# EAGLE design Grove - HCHO Sensor (EAGLE 6.3)
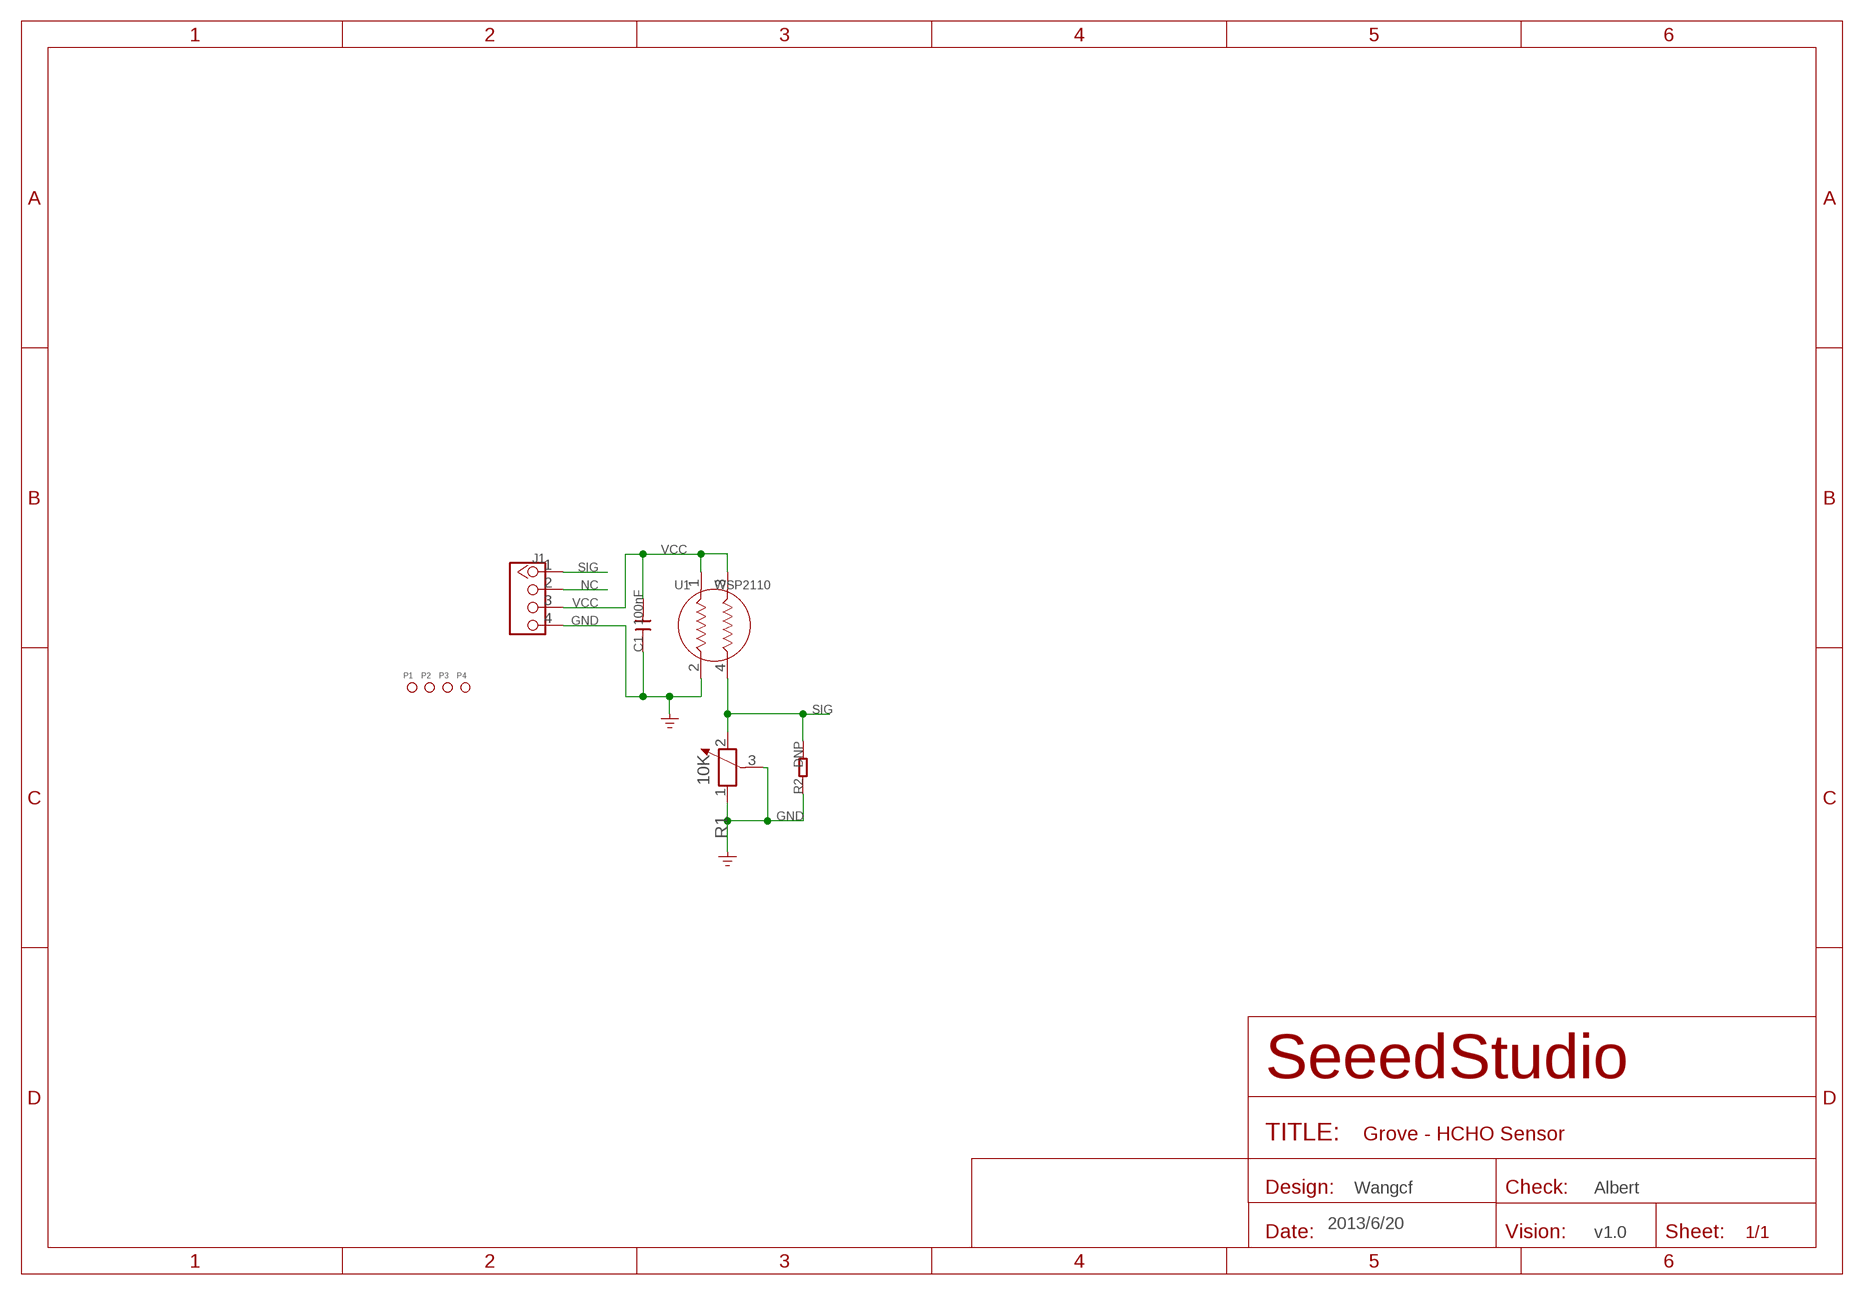
[diagram p0: schematic, sheet 1]

## Parts
C1  100nF  C-0603  [C0603]
J1  TWIG-4P-2.0-2.0  [4P-2.0]
P1  PAD-MARK  [ROUND-MARK-1.0]
P2  PAD-MARK  [ROUND-MARK-1.0]
P3  PAD-MARK  [ROUND-MARK-1.0]
P4  PAD-MARK  [ROUND-MARK-1.0]
R1  10K  R-POTENTIOMETER'3362'  [3P-SQUA-7X6.8]
R2  DNP  R-0603  [R0603]
U1  WSP2110  [4P-D9.4-7.5H]

## Nets
GND: C1.1 J1.4 R1.1 R1.3 R2.1 U1.2
NC: J1.2
SIG: J1.1 R1.2 R2.2 U1.4
VCC: C1.2 J1.3 U1.1 U1.3

## Notes on the sheet
- Wangcf | Albert
- 2013/6/20
- v1.0

## Library data of the parts
C1 = Discrete1:C*: Ceramic Capacitors
J1 = Connector :TWIG-4P-2.0
P1-P4 = Discrete:PAD-MARK; PARTNO: DNP
R1 = Discrete1:R-POTENTIOMETER*: Potentiometer
R2 = Discrete1:R*
U1 = template:WSP2110

## Board
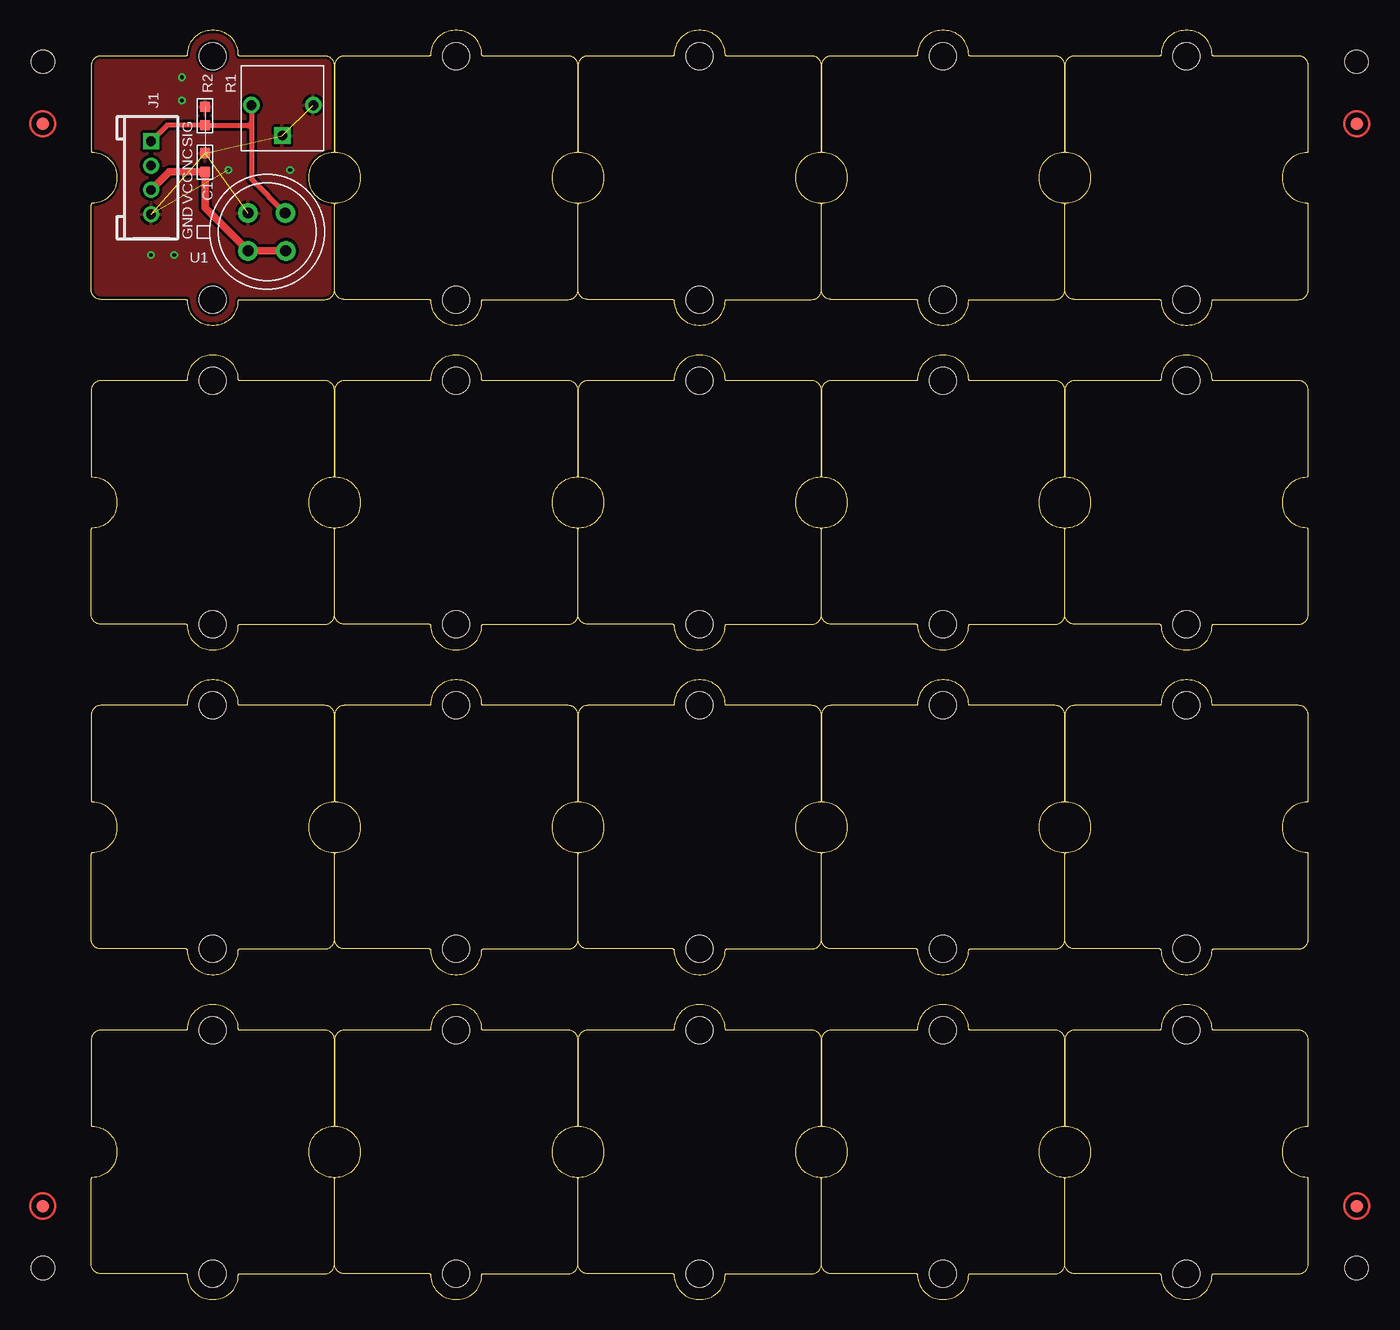
[diagram p1: board, top side]
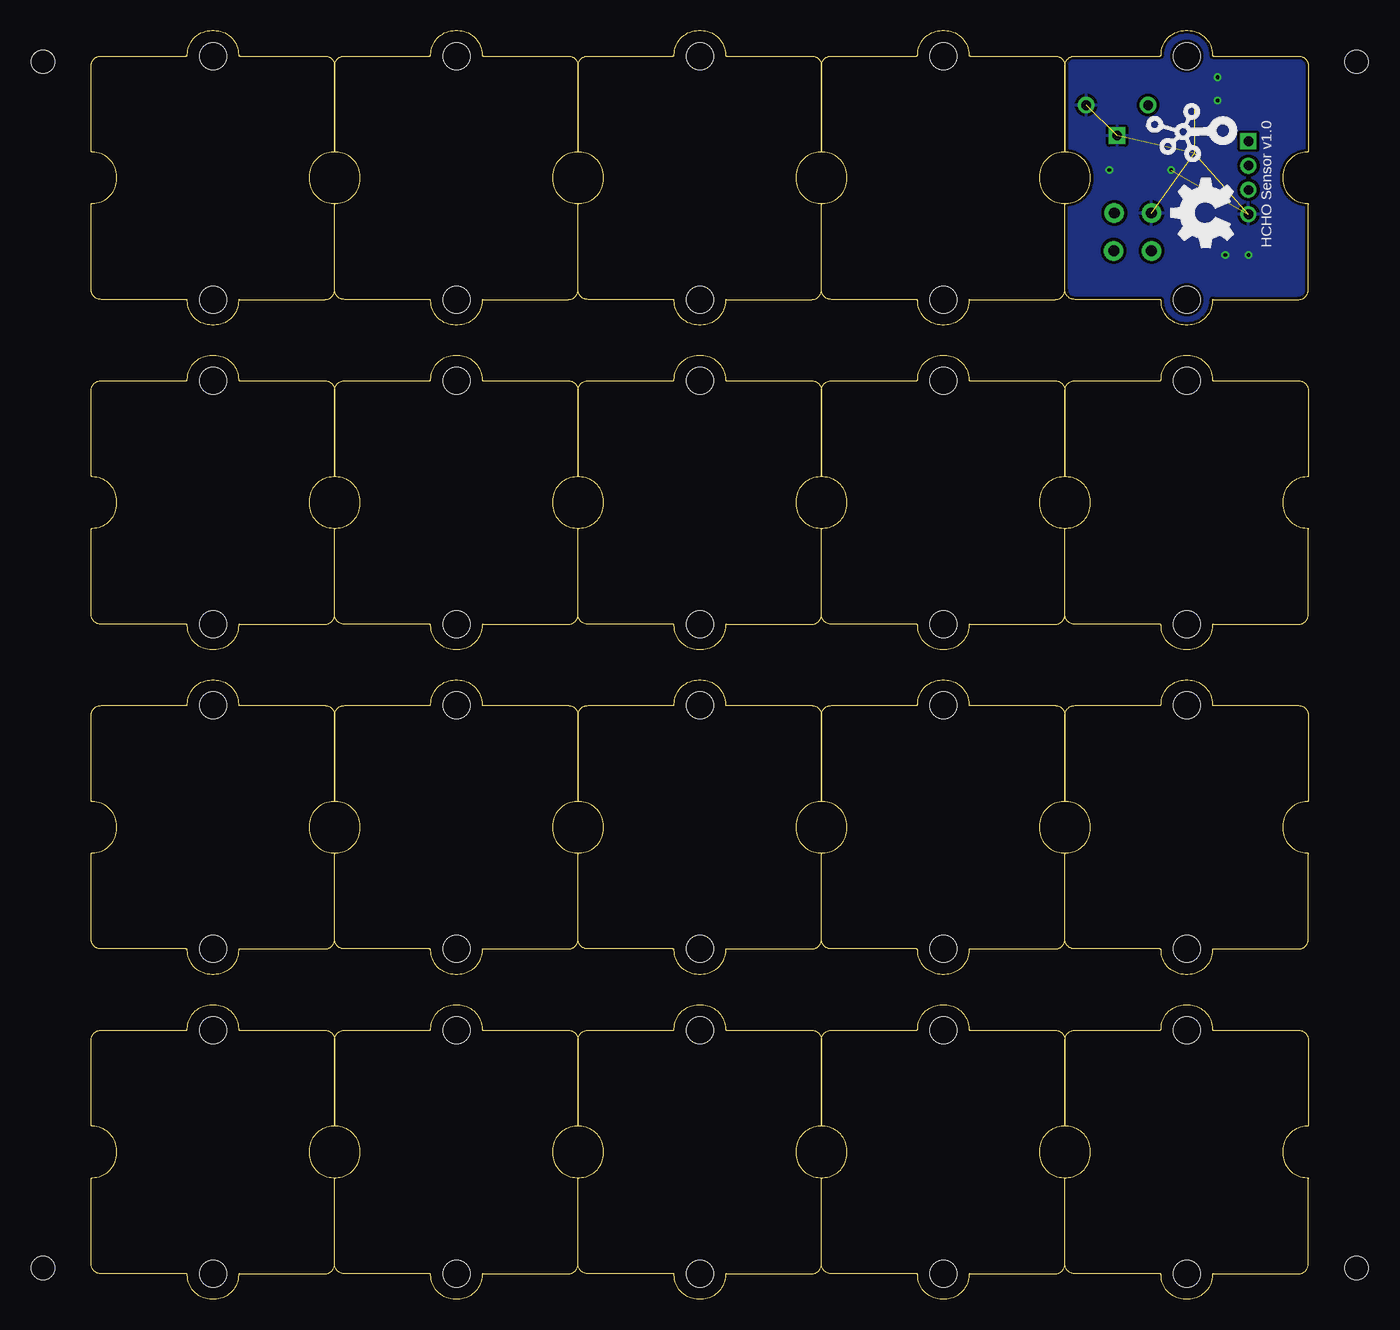
[diagram p2: board, bottom side, seen from below]

Size 100 x 104.21 mm. Coordinates in mm from the lower left corner, seen from the top.
Copper layers (1*16): Top 0.035mm / dielectric 1.5mm / Bottom 0.035mm
Design rules "SeeedStudio_DRU_no_angle_20130527 *": minimum track width 6mil, minimum drill 12mil, track to track 6mil, track to pad 6mil, pad to pad 6mil, via to via 6mil, smd to smd 0mil, copper to edge 10mil, drill to drill 10mil, minimum pad ring 10mil, minimum via ring 6mil, stop-mask expansion 2mil, vias tented up to drill 25mil, thermal gap 10mil
Holes 1.91 mm at -3.97,2.58 103.98,101.64 -3.97,101.64 103.98,2.58

### Footprints (pad centres in the part's own frame; a part is rotated, then mirrored left to right if it is on the bottom)
C0603 = smd 0.889 x 0.889: 1 -0.762,0; 2 0.762,0
4P-2.0 = drill 0.8 pad 1.27 square: 1 -3,0 | drill 0.8 pad 1.27: 2 -1,0; 3 1,0; 4 3,0
ROUND-MARK-1.0 = smd 1.016 x 1.016: P$1 0,0
3P-SQUA-7X6.8 = drill 0.8 pad 1.35: 1 -2.54,-0.25; 2 2.54,-0.25 | drill 0.8 pad 1.35 square: 3 0,2.25
R0603 = smd 0.889 x 0.889: 1 -0.762,0; 2 0.762,0
4P-D9.4-7.5H = drill 0.9 pad 1.6: 1 1.55,-1.55; 2 -1.55,-1.55; 3 1.55,1.55; 4 -1.55,1.498
1U-DIM-W/-DRILL = hole 2.2: 0,-10; 0,10

### Placement (x,y rotation side)
C1  9.37,93.38 270 top
J1  4.92,92.11 270 top
P1  -3.97,7.66 0 top  (outside the outline)
P2  -3.97,96.56 0 top  (outside the outline)
P3  103.98,96.56 0 top  (outside the outline)
P4  103.98,7.66 0 top  (outside the outline)
R1  15.71,97.83 180 top
R2  9.37,97.19 270 top
U1  14.45,87.66 270 top
U$4  [OSHW_FILLX200_NOTEXT]  6.19,86.39 90 bottom
U$5  [1U-DIM-W/-DRILL]  10,92.11 180 top
U$6  [TWIGLOGO]  6.83,95.92 90 bottom
U$7  [1U-DIM-W/-DRILL]  30,92.11 180 top
U$8  [1U-DIM-W/-DRILL]  50,92.11 180 top
U$9  [1U-DIM-W/-DRILL]  70,92.11 180 top
U$10  [1U-DIM-W/-DRILL]  90,92.11 180 top
U$11  [1U-DIM-W/-DRILL]  10,65.44 180 top
U$12  [1U-DIM-W/-DRILL]  30,65.44 180 top
U$13  [1U-DIM-W/-DRILL]  50,65.44 180 top
U$14  [1U-DIM-W/-DRILL]  70,65.44 180 top
U$15  [1U-DIM-W/-DRILL]  90,65.44 180 top
U$16  [1U-DIM-W/-DRILL]  10,38.77 180 top
U$17  [1U-DIM-W/-DRILL]  30,38.77 180 top
U$18  [1U-DIM-W/-DRILL]  50,38.77 180 top
U$19  [1U-DIM-W/-DRILL]  70,38.77 180 top
U$20  [1U-DIM-W/-DRILL]  90,38.77 180 top
U$21  [1U-DIM-W/-DRILL]  10,12.1 180 top
U$22  [1U-DIM-W/-DRILL]  30,12.1 180 top
U$23  [1U-DIM-W/-DRILL]  50,12.1 180 top
U$24  [1U-DIM-W/-DRILL]  70,12.1 180 top
U$25  [1U-DIM-W/-DRILL]  90,12.1 180 top

### Tracks (layer width: path | path; a pad name or v marks a point on that pad's centre or on a via)
GND  (via drill 0.3 pad 0.64)  (6 unrouted)
  other vias: 11.27,92.75 6.83,85.76 7.46,100.36 7.46,98.46 16.35,92.75 4.92,85.76
  pour Top (isolate 0.254): -0.16,80.05 20.16,80.05 20.16,104.17 -0.16,104.17
  pour Bottom (isolate 0.254): -0.16,80.05 20.16,80.05 20.16,104.17 -0.16,104.17
SIG
  Top 0.406: J1.1 6.24,96.43 R2.2 12.92,96.43 | R1.2 13.18,96.68 | 13.18,96.68 13.18,96.43 | 13.18,96.43 13.18,96.17 | 13.18,96.17 13.18,91.98 U1.4 | 12.92,96.43 13.18,96.43 | 12.92,96.43 13.18,96.68 | 12.92,96.43 13.18,96.17
VCC
  Top 0.61: J1.3 6.43,92.62 C1.2 9.37,89.64 U1.1 U1.3

### Text on the board
tPlace: SIG | NC | VCC | GND
bPlace: HCHO Sensor v1.0